# Altium schematic sheet OC_PROT.SchDoc
size C; SheetNumber: 2; SheetTotal: 6
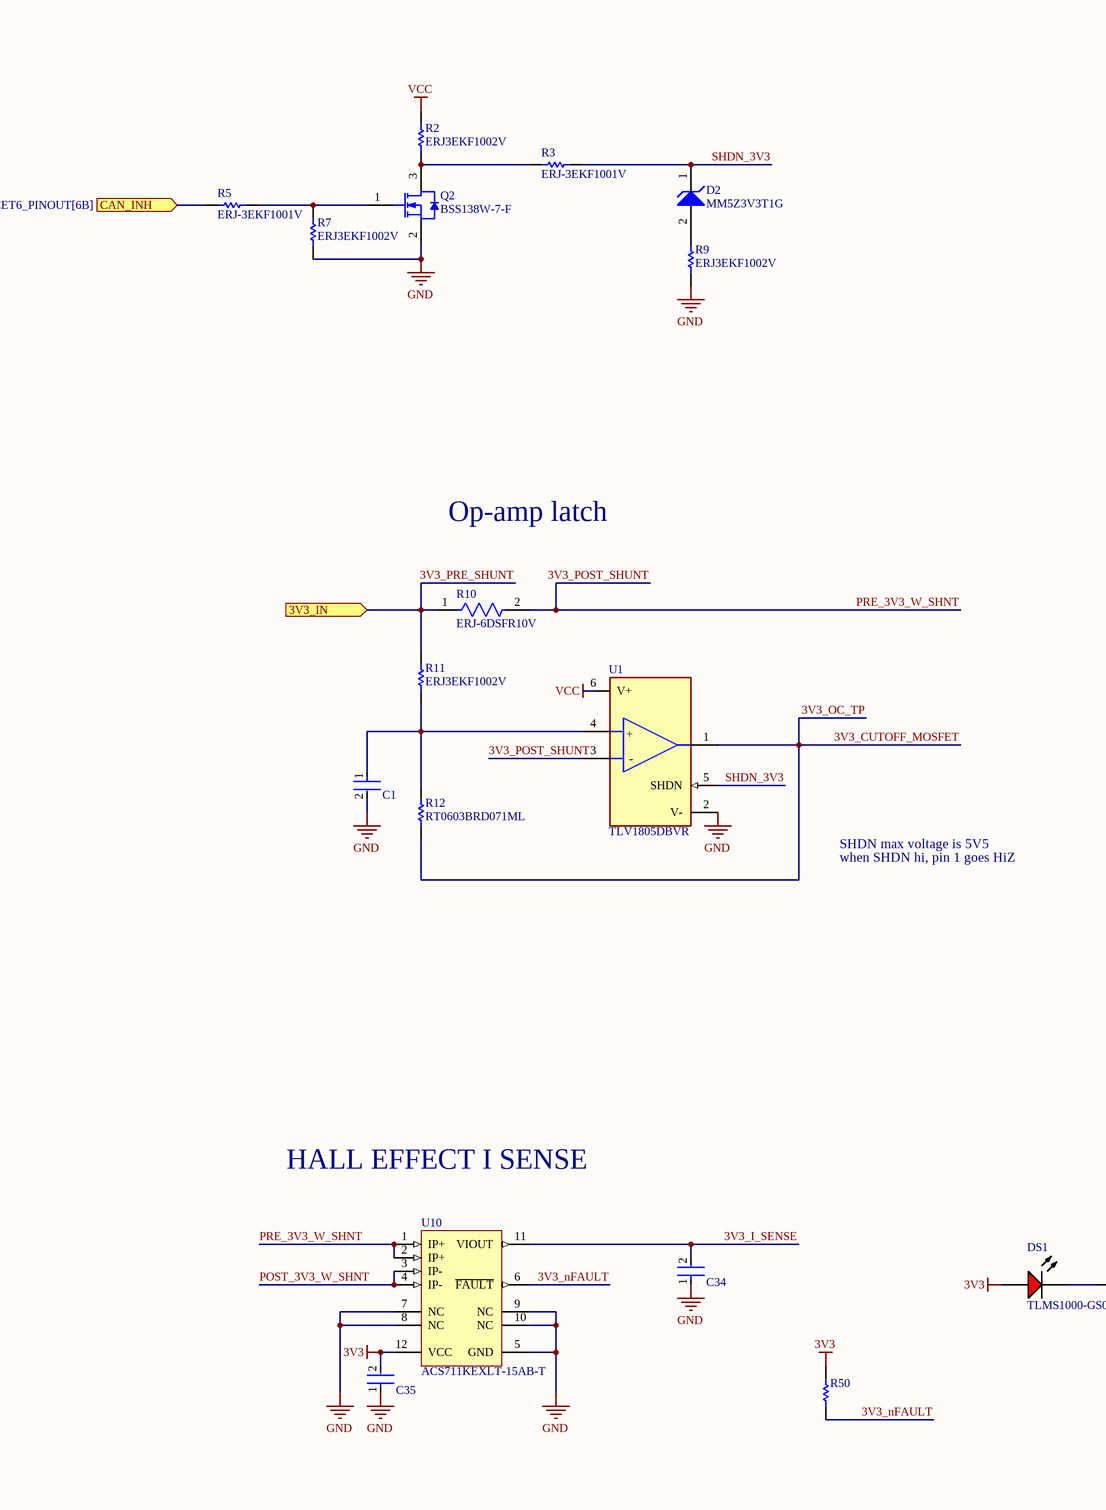
[diagram p0: OC_PROT.SchDoc, left]
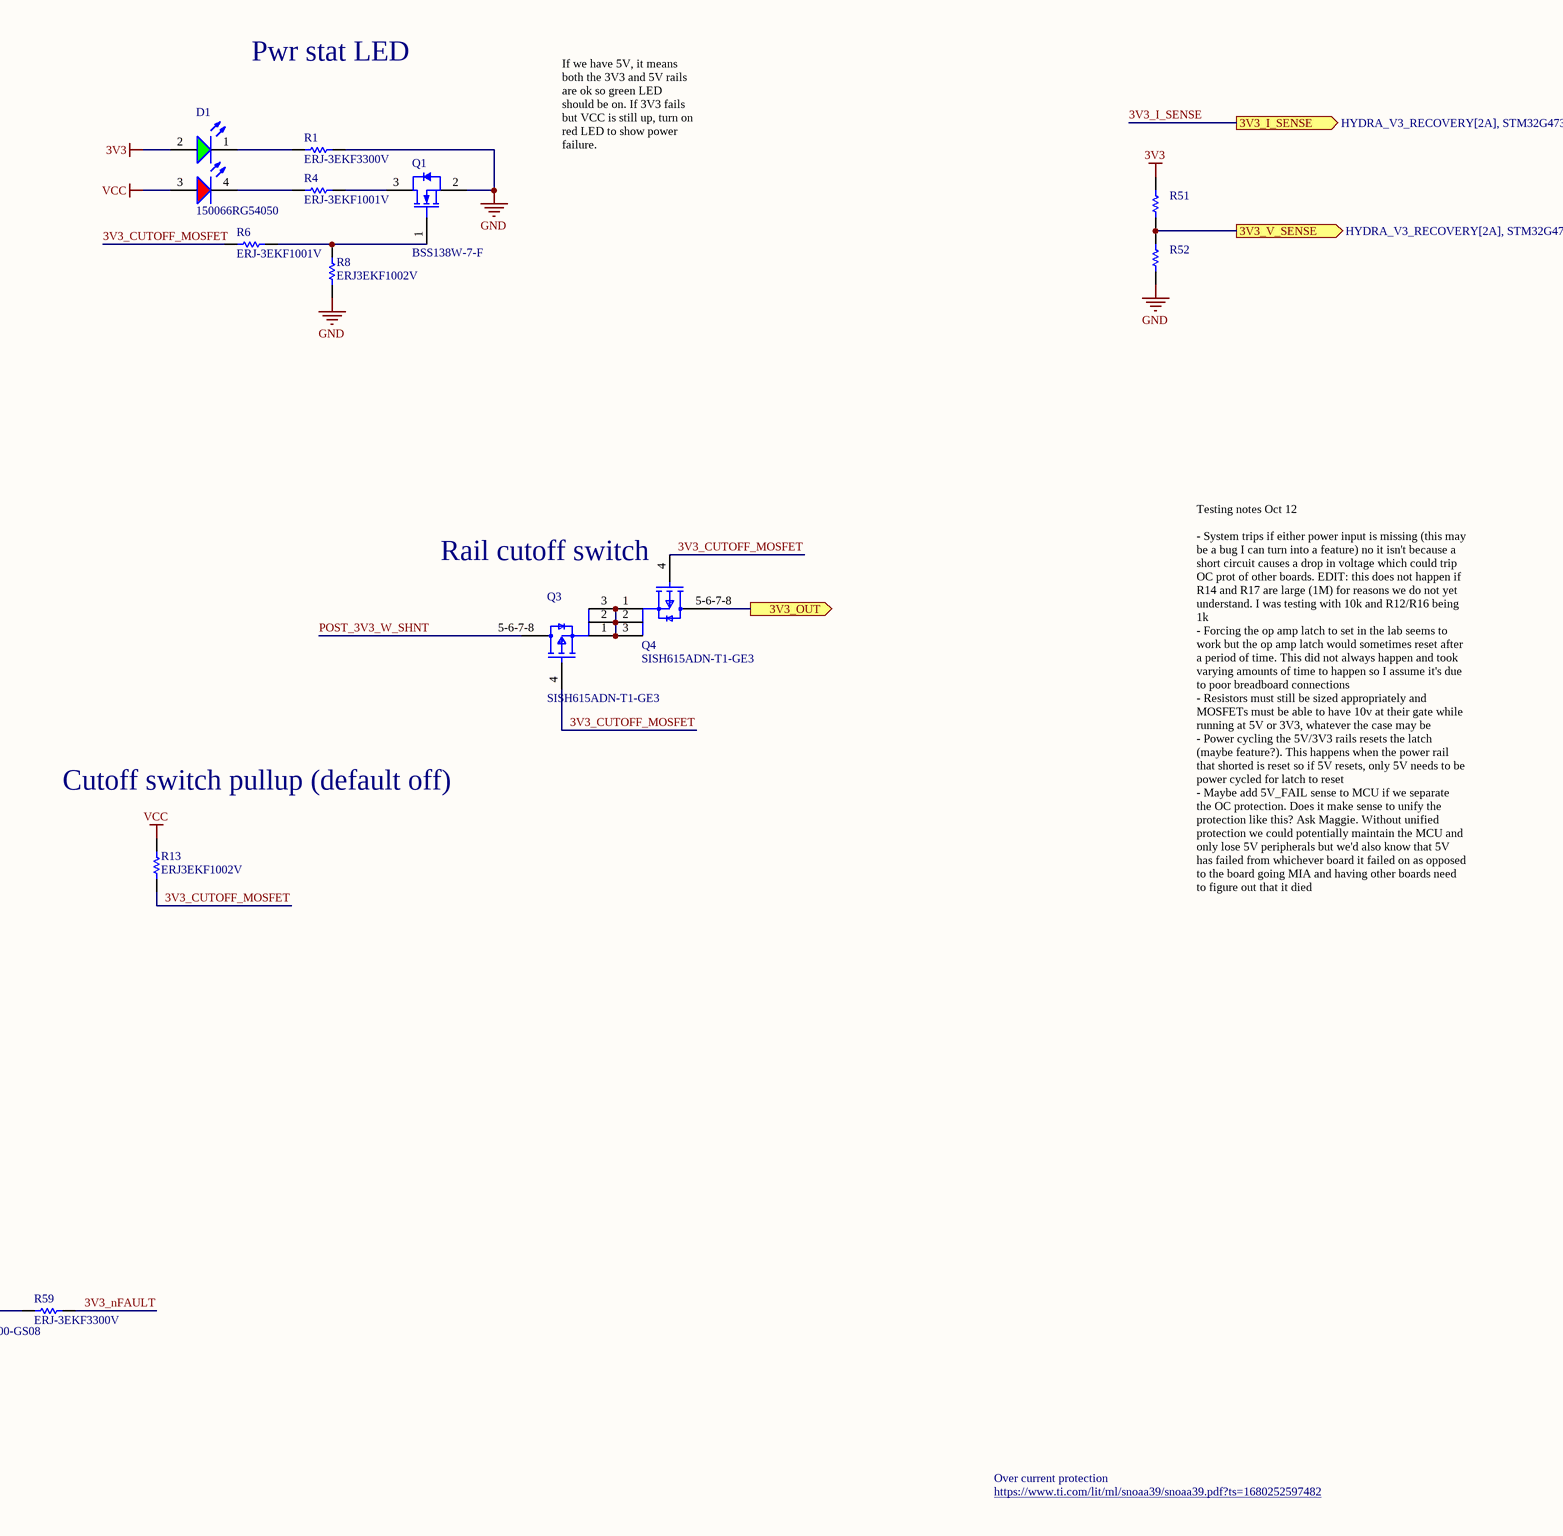
[diagram p1: OC_PROT.SchDoc, right]

## Parts
C1  C0402C104K8PACTU  [FP-C0402-BB-MFG]  (value not drawn)
C34  C0402C104K8PACTU  [FP-C0402-BB-MFG]  (value not drawn)
C35  C0402C104K8PACTU  [FP-C0402-BB-MFG]  (value not drawn)
D1  150066RG54050  [WL-SBCD_0606]
D2  MM5Z3V3T1G  [ONSC-SOD-523-2-502-01_V]
DS1  TLMS1000-GS08  [VISH-TLMS1000_V]
Q1  BSS138W-7-F  [DIOD-SOT323-3_V]
Q2  BSS138W-7-F  [DIOD-SOT323-3_V]
Q3  SISH615ADN-T1-GE3  [SISH615ADN-T1-GE3-Footprint-1]
Q4  SISH615ADN-T1-GE3  [SISH615ADN-T1-GE3-Footprint-1]
R1  ERJ-3EKF3300V  [RESC1608X55X30LL15T15]
R2  ERJ3EKF1002V  [RESC1609X55X30LL15T15]
R3  ERJ-3EKF1001V  [RESC1608X55X30LL15T15]
R4  ERJ-3EKF1001V  [RESC1608X55X30LL15T15]
R5  ERJ-3EKF1001V  [RESC1608X55X30LL15T15]
R6  ERJ-3EKF1001V  [RESC1608X55X30LL15T15]
R7  ERJ3EKF1002V  [RESC1609X55X30LL15T15]
R8  ERJ3EKF1002V  [RESC1609X55X30LL15T15]
R9  ERJ3EKF1002V  [RESC1609X55X30LL15T15]
R10  ERJ-6DSFR10V  [FP-ERJ6D-MFG]
R11  ERJ3EKF1002V  [RESC1609X55X30LL15T15]
R12  RT0603BRD071ML  [RESC1608X55X30NL20T20]
R13  ERJ3EKF1002V  [RESC1609X55X30LL15T15]
R50  ERJ3EKF1002V  [RESC1609X55X30LL15T15]  (value not drawn)
R51  ERJ3EKF1002V  [RESC1609X55X30LL15T15]  (value not drawn)
R52  ERJ3EKF1002V  [RESC1609X55X30LL15T15]  (value not drawn)
R59  ERJ-3EKF3300V  [RESC1608X55X30LL15T15]
U1  TLV1805DBVR  [FP-DBV0006A-IPC_C]
U10  ACS711KEXLT-15AB-T  [ALEG-EX-12_V]

## Ports
3V3_I_SENSE (out, see HYDRA_V3_RECOVERY[2A], STM32G473CET6_PINOUT[4A]), 3V3_IN (in, see HYDRA_V3_RECOVERY[2A]), 3V3_OUT (out, see HYDRA_V3_RECOVERY[2A]), 3V3_V_SENSE (out, see HYDRA_V3_RECOVERY[2A], STM32G473CET6_PINOUT[4A]), CAN_INH (in, see HYDRA_V3_RECOVERY[2A], STM32G473CET6_PINOUT[6B])

## Nets
3V3: C35.2 D1.2(A) DS1.1(A) R50.2 R51.1 U10.12(VCC)
GND: C1.2 C34.1 C35.1 Q1.2(S) Q2.2(S) R1.2 R7.1 R8.1 R9.1 R52.2 U1.2(V-) U10.5(GND) U10.7(NC) U10.8(NC) U10.9(NC) U10.10(NC)
VCC: D1.3(A) R2.2 R13.1 U1.6(V+)
3V3_CUTOFF_MOSFET: Q3.4(G) Q4.4(G) R6.2 R12.1 R13.2 U1.1(OUT)  [also labelled 3V3_OC_TP]
3V3_I_SENSE: C34.2 U10.11(VIOUT) ; port 3V3_I_SENSE
3V3_nFAULT: R50.1 R59.2 U10.6(~{FAULT})
3V3_OUT: Q4.5-6-7-8(D) ; port 3V3_OUT
3V3_POST_SHUNT: R10.2 U1.3(-IN) U10.1(IP+) U10.2(IP+)  [also labelled PRE_3V3_W_SHNT]
3V3_PRE_SHUNT: R10.1 R11.2 ; port 3V3_IN
3V3_V_SENSE: R51.2 R52.1 ; port 3V3_V_SENSE
CAN_INH: R5.2 ; port CAN_INH
POST_3V3_W_SHNT: Q3.5-6-7-8(D) U10.3(IP-) U10.4(IP-)
SHDN_3V3: D2.1(K) R3.2 U1.5(SHDN)
NetC1_1: C1.1 R11.1 R12.2 U1.4(+IN)
NetD1_1: D1.1(K) R1.1
NetD1_4: D1.4(K) R4.2
NetD2_2: D2.2(A) R9.2
NetDS1_2: DS1.2(K) R59.1
NetQ1_1: Q1.1(G) R6.1 R8.2
NetQ1_3: Q1.3(D) R4.1
NetQ2_1: Q2.1(G) R5.1 R7.2
NetQ2_3: Q2.3(D) R2.1 R3.1
NetQ3_1: Q3.1(S) Q3.2(S) Q3.3(S) Q4.1(S) Q4.2(S) Q4.3(S)

## Notes on the sheet
- Pwr stat LED
- If we have 5V, it means both the 3V3 and 5V rails are ok so green LED should be on. If 3V3 fails but VCC is still up, turn on red LED to show power failure.
- Op-amp latch
- (near Q4) Rail cutoff switch
- Cutoff switch pullup (default off)
- SHDN max voltage is 5V5
- when SHDN hi, pin 1 goes HiZ
- Testing notes Oct 12
  - System trips if either power input is missing (this may be a bug I can turn into a feature) no it isn't because a short circuit causes a drop in voltage which could trip OC prot of other boards. EDIT: this does not happen if R14 and R17 are large (1M) for reasons we do not yet understand. I was testing with 10k and R12/R16 being 1k
  - Forcing the op amp latch to set in the lab seems to work but the op amp latch would sometimes reset after a period of time. This did not always happen and took varying amounts of time to happen so I assume it's due to poor breadboard connections
  - Resistors must still be sized appropriately and MOSFETs must be able to have 10v at their gate while running at 5V or 3V3, whatever the case may be
  - Power cycling the 5V/3V3 rails resets the latch (maybe feature?). This happens when the power rail that shorted is reset so if 5V resets, only 5V needs to be power cycled for latch to reset
  - Maybe add 5V_FAIL sense to MCU if we separate the OC protection. Does it make sense to unify the protection like this? Ask Maggie. Without unified protection we could potentially maintain the MCU and only lose 5V peripherals but we'd also know that 5V has failed from whichever board it failed on as opposed to the board going MIA and having other boards need to figure out that it died
- HALL EFFECT I SENSE
- https://www.ti.com/lit/ml/snoaa39/snoaa39.pdf?ts=1680252597482
- Over current protection
- (in symbol CMP-04896-000098-1) +; -

## Library data of the parts
C1 C34 C35 = CMP-2008-02046-2: CAP CER 0.1UF 10V X5R 0402; Manufacturer: Kemet; Material: Ceramic; Capacitance: 0.10 μF; Temperature Coefficient: 15%; Tolerance: 0.1; Value: 0.10 μF; Package: C0402-BB; Temperature: -55°C to +125°C; ComponentLink2Description: Datasheet; Temperature Characteristic: X5R; Device Class L1: Passive Components; Height: 0.55mm; Lead Free: Yes; ComponentLink2URL: https://content.kemet.com/datasheets/KEM_C1002_X7R_SMD.pdf; Device Class L2: Capacitors; Temperature Range Low: -55°C; Temperature Range High: +125°C; RoHS: TRUE; Octopart: https://octopart.com/c0402c104k8pactu-kemet-140039; Automotive: No; Mouser Description: Capacitor 100 nF 10 VDC 0402; Category: Cap; Voltage Rating: 10 V; Digikey Description: CAP CER 0.1UF 10V X5R 0402; Ipc Land Pattern Name: CAPC10050X50; Device Class L3: Ceramic Capacitors; Manufacturer Part Number: C0402C104K8PACTU
D1 = CMP-004-00040-2: Led, Red/Grn, 180Mcd/230Mcd, 624Nm/525Nm Rohs Compliant: Yes; Source: rgled.SchLib; Component Type: Standard; Design Item ID: CMP-004-00034-2; Pins: 4
D2 = CMP-1060-00750-1: Zener Voltage Regulator, 500 mW, 2-Pin SOD-523, Pb-Free, Tape and Reel; Manufacturer: On Semiconductor; P Max (W): 0.5; VZ Typ (V): 3.3; RoHS: Pb-Free; ComponentLink2Description: Datasheet; PackageReference: SOD-523-2-502-01; DatasheetVersion: Rev. 10; ComponentLink1Description: Manufacturer URL; PackageVersion: Rev. E, 09/2010; ComponentLink3URL: http://www.onsemi.com/pub_link/Collateral/502-01.PDF; ComponentLink2URL: http://www.onsemi.cn/pub_link/Collateral/MM5Z2V4T1-D.PDF; Mounting Technology: Surface Mount; PartNumber: MM5Z3V3T1G; Packing: Tape and Reel; PackageDescription: 2-Pin SOD, Body 1.2 x 0.8 mm; ComponentLink1URL: http://www.onsemi.com/; ComponentLink3Description: Package Specification
DS1 = CMP-2000-07254-1: Low Current LED, 40 mW, 1.8 V, -40 to 100 degC, 2-Pin SMD (0603), RoHS, Tape and Reel; Manufacturer: Vishay; Lens Shape: Rectangular; Automotive Qualification Standard: AEC-Q100; Wavelength Typ: 636nm; SVHC: ToBeAdvised; LED Colour: Red; Bulb Size: 1.6mmx0.8mm; Forward Voltage: 1.8V; Luminous Intensity: 4mcd; Forward Current If: 2mA; Viewing Angle: 80°; Datasheet Version: Rev. 1.7, 02/2011; Datasheet URL: https://datasheet.ciiva.com/5798/1698881-5798337.pdf; LED Mounting: SMD; Packaging: CutTape; Package Reference: TLMS1000; Manufacturer URL: http://www.vishay.com/; Mounting Technology: SurfaceMount; Product Range: -; Package Description: 2-Pin Surface Mount Device, Body 1.6 x 0.8 mm; MSL: MSL2-1year
Q1 Q2 = CMP-2000-05968-1: N-Channel Enhancement Mode Mosfet, 50 V, 200 mA, -55 to 150 degC, 6-Pin SOT-323, RoHS, Tape and Reel; Typical Turn-Off Delay Time: 20ns; Number of Channels: 1Channel; Type: EnhancementModeFieldEffectTransistor; Brand: DiodesIncorporated; Vds - Drain-Source Breakdown Voltage: 75V; Vgs - Gate-Source Voltage: 20V; Rds On - Drain-Source Resistance: 1.4Ohms; Transistor Type: 1N-Channel; Configuration: Single; Unit Weight: 0.000212oz; Pd - Power Dissipation: 200mW; Id - Continuous Drain Current: 200mA; Forward Transconductance - Min: 0.1S; Manufacturer URL: http://www.diodes.com/; Series: BSS138; Package Description: 3-Pin Small Outline Transistor, Body 2 x 1.25 mm, Pitch 0.65 mm; Mounting Technology: SurfaceMount; Product Category: MOSFET; RoHS: True; Maximum Operating Temperature: +150C; Height: 1mm; Length: 2.2mm; Technology: Si; Width: 1.35mm; Datasheet URL: http://www.diodes.com/_files/datasheets/ds30206.pdf; Manufacturer: DiodesIncorporated; Package / Case: SOT-323-3; Typical Turn-On Delay Time: 20ns; Transistor Polarity: N-Channel; Factory Pack Quantity: 3000; Packaging: Reel; Product: MOSFETSmallSignal; Datasheet Version: Rev. 11-2, 09/2013; Package Reference: SOT323; Minimum Operating Temperature: -55C; Mounting Style: SMD/SMT; Channel Mode: Enhancement
Q3 Q4 = CMP-013-00018-2: Trans MOSFET P-CH 20V 22.1A 8-Pin PowerPAK 1212 EP T/R; Source: SISH615ADN-T1-GE3.SchLib; Design Item ID: CMP-013-00036-4; Component Type: Standard; Pins: 5
R1 R59 = CMP-2000-00435-2: Chip Resistor, 330 Ohm, +/- 1%, 0.1 W, -55 to 155 degC, 0603 (1608 Metric), RoHS, Tape and Reel; Gender: Male; Mating Cycles: 10000; Current Rating: 500 mA; Voltage Rating: 10 V; REACH SVHC: No SVHC; PackageDescription: 2-Pin Surface Mount Device, Body 1.6 x 0.85 mm; Contact Finish: Gold; Pins: 8; ComponentLink1Description: Manufacturer URL; Packaging: Tape and Reel; Max Operating Temperature: 85 degC; Contact Material: Copper; Height: 1.45 mm; Width: 1.45 mm; DatasheetVersion: Apr-15; Package Quantity: 1500; Contact Plating: Gold; PackageReference: 0603; Mount: Surface Mount; Lead Pitch: 1.1 mm; Min Operating Temperature: -25 degC; ComponentLink1URL: http://www.panasonic.com/; ComponentLink2URL: http://industrial.panasonic.com/cdbs/www-data/pdf/RDA0000/AOA0000C86.pdf; Length: 13.7 mm; ComponentLink2Description: Datasheet; RoHSCompliant: true
R2 R7-R9 R11 R13 R50-R52 = CMP-1012-00623-3: Chip Resistor, 10 KOhm, +/- 1%, 0.1 W, -55 to 155 degC, 0603 (1608 Metric), RoHS, Tape and Reel; Manufacturer: Panasonic; Voltage Rating: 75V; Case\/Package: 0603; Power Rating: 100mW; Resistance: 10KOhm; Temperature Coefficient: 100ppm\/degreesC; Number of Pins: 2; Package Reference: 603; Depth: 0.8mm; Mount: SurfaceMount; Package Description: 2-Pin Surface Mount Device, Body 1.6 x 0.85 mm; Datasheet Version: 02/2017; Length: 1.6mm; Lead Free: LeadFree; Height: 0.45mm; Number of Terminations: 2; Max Power Dissipation: 100mW; Min Operating Temperature: -55degC; Datasheet URL: https://industrial.panasonic.com/cdbs/www-data/pdf/RDA0000/AOA0000C304.pdf; Termination: SMD/SMT; Case Code (Metric): 1608; Case Code (Imperial): 0603; Tolerance: 1%; Max Operating Temperature: 155degC; RoHSCompliant: true; Voltage Rating (DC): 75V; Radiation Hardening: No; Packaging: TapeandReel; Composition: ThickFilm; Mounting Technology: SurfaceMount; Manufacturer URL: http://www.panasonic.com/; Width: 0.031inch; REACH SVHC: NoSVHC; Contact Plating: Tin; Military Standard: Not; Package Quantity: 1
R3-R6 = CMP-2000-00180-1: Manufacturer: Panasonic; Part Number: ERJ-3EKF1001V
R10 = CMP-05422-000098-1: RES 0.1 OHM 1% 1/2W 0805; Temperature Coefficient: 150ppm/°C; Resistance: 100mR; Max Power Dissipation: 500mW; Tolerance: 1%; Length: 0.079inch; Features: Automotive AEC-Q200; Width: 0.049inch; Resistor Type: Thick Film; Case Code (Metric): 2012; Number of Terminations: 2; Max Operating Temperature: 155°C; Case/Package: 0805; Height: 0.028inch; Packaging: Cut Tape; Case Code (Imperial): 0805; Min Operating Temperature: -55°C
R12 = CMP-2000-00925-1: NOT PANASONIC, THIS IS A 1M RESISTORhttps://www.yageo.com/upload/media/product/productsearch/datasheet/rchip/PYu-RT_1-to-0.01_RoHS_L_13.pdf; Part Number: ERA-3AEB163V; Manufacturer: Panasonic
U1 = CMP-04896-000098-1: 40V, RAIL-TO-RAIL INPUT, PUSH-PU
U10 = CMP-1557-00001-1: Hall Effect Linear Current Sensor with Overcurrent Fault Output for <100 V Isolation Applications, 3 to 5.5 V, -15.5 to 15.5 A IP, -40 to 125 degC, 12-Pin QFN (EX), RoHS, Tape and Reel; VCC Max: 5.5 V; IP Max: 15.5 A; VCC Min: 3 V; IP Min: -15.5 A; -3dB Bandwidth: 0.1 MHz; PackageDescription: 12-Pin Quad Flat No-Lead, Body 3 x 3 mm, Height 0.8 mm; ComponentLink1URL: http://www.allegromicro.com/; Packing: Tape and Reel; ComponentLink2URL: http://www.allegromicro.com/~/media/Files/Datasheets/ACS711-Datasheet.ashx?la=en; DatasheetVersion: Rev. 3; PartNumber: ACS711KEXLT-15AB-T; ComponentLink2Description: Datasheet; ComponentLink3URL: http://www.allegromicro.com/~/media/Files/Datasheets/ACS711-Datasheet.ashx?la=en; RoHS: TRUE; ComponentLink1Description: Manufacturer URL; ComponentLink3Description: Package Specification; Temperature Max: 125 degC; Mounting Technology: Surface Mount; Temperature Min: -40 degC